# EAGLE schematic jejsmd.io (EAGLE 9.7.0)
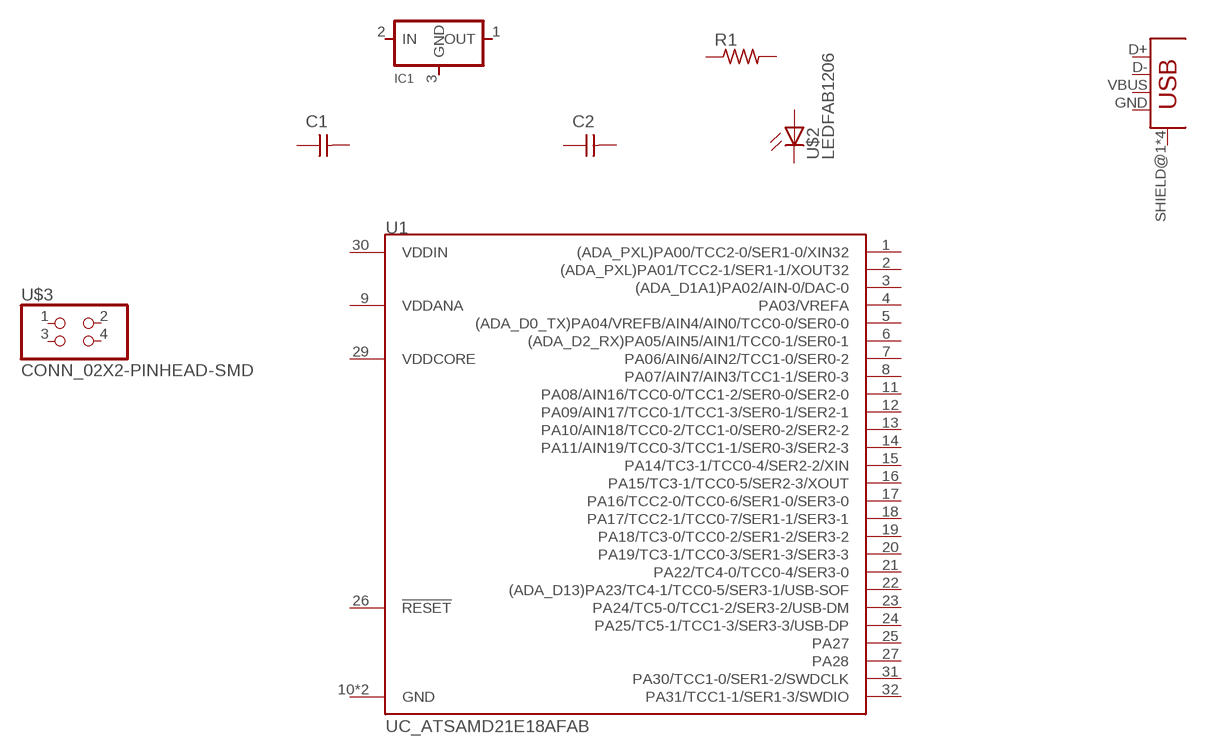
[diagram p0: schematic, sheet 1]

## Parts
C1  CAP_UNPOLARIZEDFAB  [C1206FAB]
C2  CAP_UNPOLARIZEDFAB  [C1206FAB]
IC1  VR_REGULATOR-SOT23SOT23  [SOT23]
R1  R1206FAB  [R1206FAB]
U1  UC_ATSAMD21E18AFAB  [TQFP-32-FAB]
U$1  CONN_USB_MINIB  [USB_MINIB]
U$2  LEDFAB1206  [LED1206FAB]
U$3  CONN_02X2-PINHEAD-SMD  [2X02SMD]
Unconnected: C1.1 C1.2 C2.1 C2.2 IC1.1(OUT) IC1.2(IN) IC1.3(GND) R1.1 R1.2 U1.1((ADA_PXL)PA00/TCC2-0/SER1-0/XIN32) U1.2((ADA_PXL)PA01/TCC2-1/SER1-1/XOUT32) U1.3((ADA_D1A1)PA02/AIN-0/DAC-0) U1.4(PA03/VREFA) U1.5((ADA_D0_TX)PA04/VREFB/AIN4/AIN0/TCC0-0/SER0-0) U1.6((ADA_D2_RX)PA05/AIN5/AIN1/TCC0-1/SER0-1) U1.7(PA06/AIN6/AIN2/TCC1-0/SER0-2) U1.8(PA07/AIN7/AIN3/TCC1-1/SER0-3) U1.11(PA08/AIN16/TCC0-0/TCC1-2/SER0-0/SER2-0) U1.12(PA09/AIN17/TCC0-1/TCC1-3/SER0-1/SER2-1) U1.13(PA10/AIN18/TCC0-2/TCC1-0/SER0-2/SER2-2) U1.14(PA11/AIN19/TCC0-3/TCC1-1/SER0-3/SER2-3) U1.15(PA14/TC3-1/TCC0-4/SER2-2/XIN) U1.16(PA15/TC3-1/TCC0-5/SER2-3/XOUT) U1.17(PA16/TCC2-0/TCC0-6/SER1-0/SER3-0) U1.18(PA17/TCC2-1/TCC0-7/SER1-1/SER3-1) U1.19(PA18/TC3-0/TCC0-2/SER1-2/SER3-2) U1.20(PA19/TC3-1/TCC0-3/SER1-3/SER3-3) U1.21(PA22/TC4-0/TCC0-4/SER3-0) U1.22((ADA_D13)PA23/TC4-1/TCC0-5/SER3-1/USB-SOF) U1.23(PA24/TC5-0/TCC1-2/SER3-2/USB-DM) U1.24(PA25/TC5-1/TCC1-3/SER3-3/USB-DP) U1.25(PA27) U1.26(!RESET) U1.27(PA28) U1.31(PA30/TCC1-0/SER1-2/SWDCLK) U1.32(PA31/TCC1-1/SER1-3/SWDIO) U$1.D+ U$1.D- U$1.GND U$1.SHIELD@1(SHIELD) U$1.SHIELD@2(SHIELD) U$1.SHIELD@3(SHIELD) U$1.SHIELD@4(SHIELD) U$1.VBUS U$2.1(A) U$2.2(C) U$3.1 U$3.2 U$3.3 U$3.4

## Power pins joined to a net without a drawn wire
GND: U1.10(GND) U1.28(GND)
VDDANA: U1.9(VDDANA)
VDDCORE: U1.29(VDDCORE)
VDDIN: U1.30(VDDIN)

## Library data of the parts
C1 C2 = fab_JEJ:CAP_UNPOLARIZED
IC1 = fab_JEJ:VR_REGULATOR-SOT23
R1 = fab_JEJ:R: Resistor (US Symbol) Variants with postfix FAB are widened to allow the routing of internal traces
U1 = fab_JEJ:UC_ATSAMD21E18A: The SAM D21 is a series of low-power microcontrollers using the 32-bit ARM® Cortex® -M0+ processor, and ranging from 32- to 64-pins with up to 256KB Flash and 32KB of SRAM. The SAM D21 operate at a maximum frequency of 48MHz and reach 2.46 CoreMark® /MHz. Check prices <https://pricing.snapeda.com/parts/ATSAMD21E18A-AF/Microchip/view-part?ref=eda>
U$1 = fab_JEJ:CONN_USB_MINIB
U$2 = fab_JEJ:LED: LED
U$3 = fab_JEJ:CONN_02X2-PINHEAD-SMD